# EAGLE design mimamori-hat-v03 (EAGLE 7.7.0)
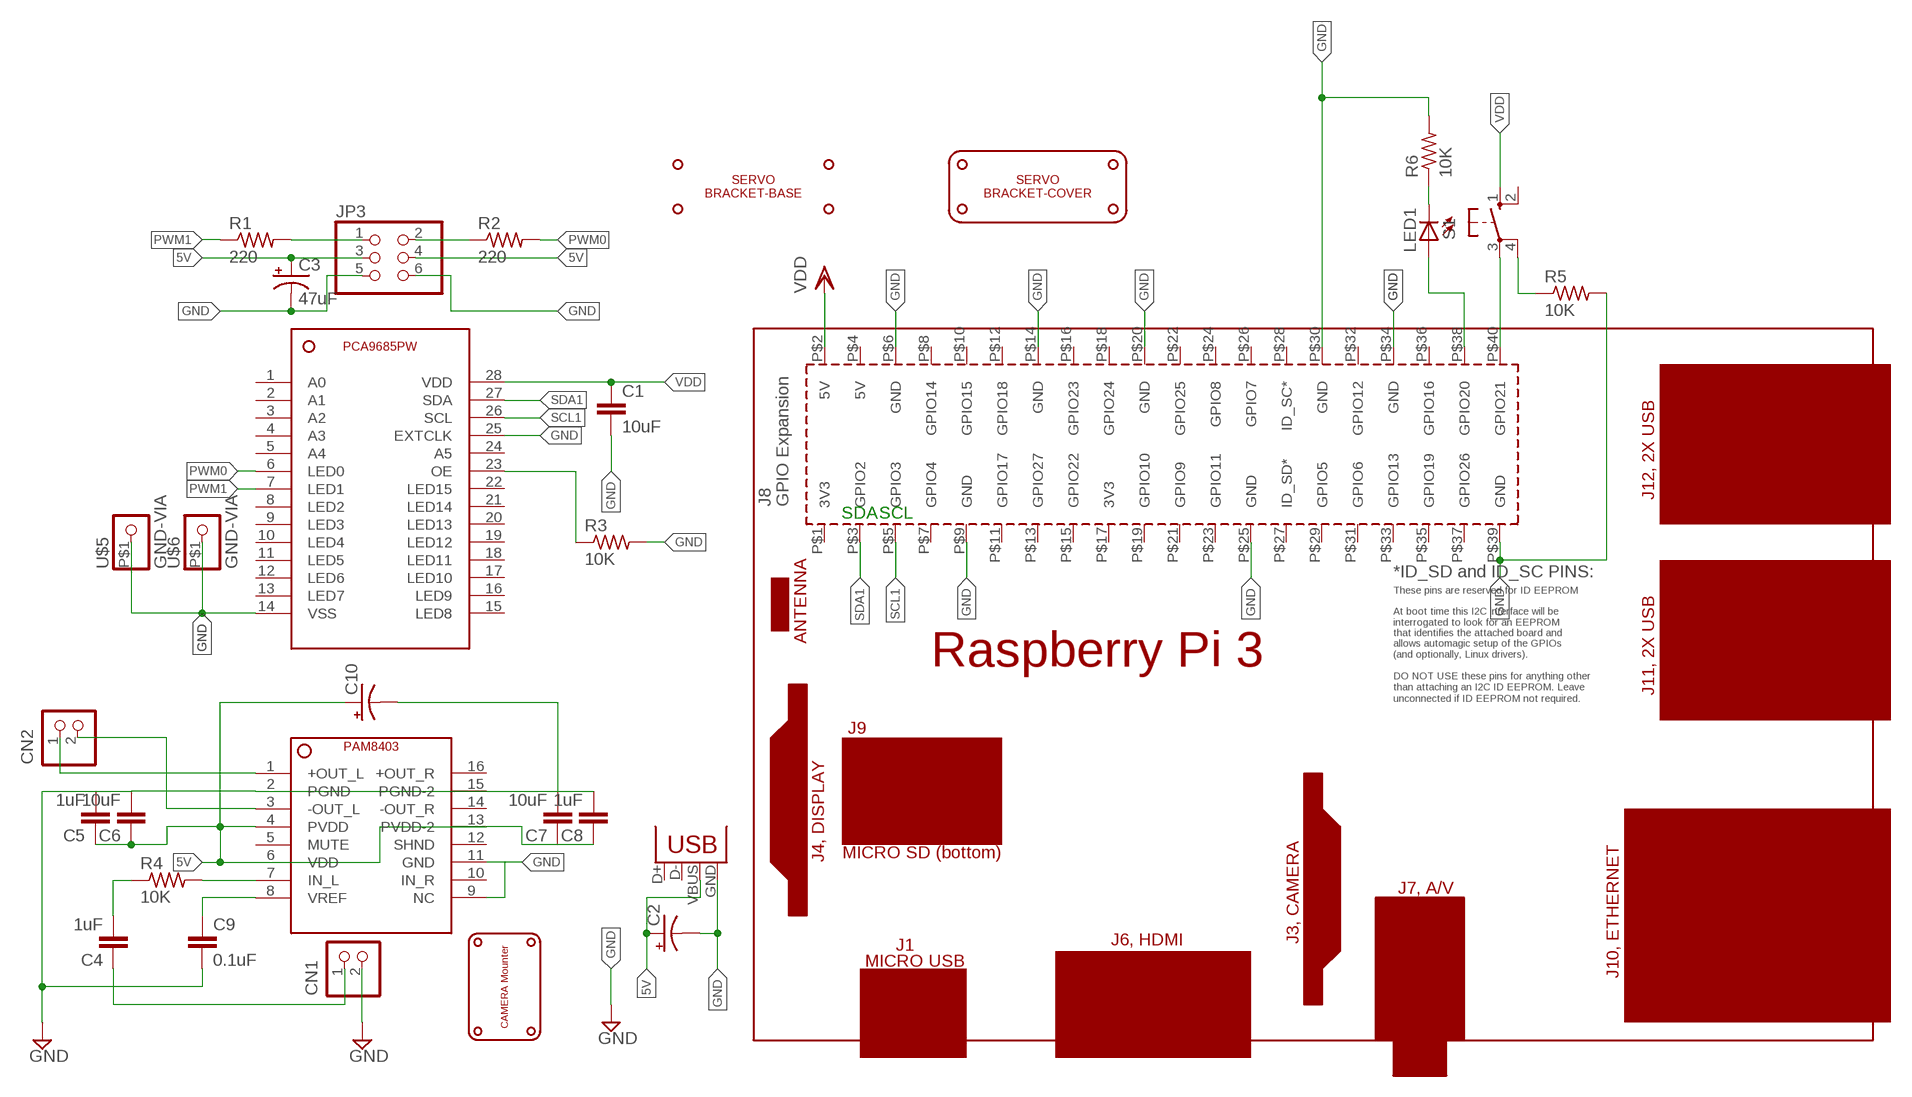
[diagram p0: schematic, sheet 1]

## Parts
C1  10uF  C-EUC0805  [C0805]
C2  CPOL-US153CLV-0810  [153CLV-0810]
C3  47uF  CPOL-US153CLV-0605  [153CLV-0605]
C4  1uF  C-EUC0805  [C0805]
C5  1uF  C-EUC0805  [C0805]
C6  10uF  C-EUC0805  [C0805]
C7  10uF  C-EUC0805  [C0805]
C8  1uF  C-EUC0805  [C0805]
C9  0.1uF  C-EUC0805  [C0805]
C10  CPOL-US153CLV-0810  [153CLV-0810]
CN1  B2B-PH-K-S  [B2B-PH-K-S]
CN2  B2B-PH-K-S  [B2B-PH-K-S]
JP1  USB-MICROB  [USB-MICROB]
JP3  PINHD-2X3  [2X03]
LED1  LED3MM  [LED3MM]
PCB1  RPI3  [RPI3]
R1  220  R-US_R0805  [R0805]
R2  220  R-US_R0805  [R0805]
R3  10K  R-US_R0805  [R0805]
R4  10K  R-US_R0805  [R0805]
R5  10K  R-US_R0805  [R0805]
R6  10K  R-US_R0805  [R0805]
S1  10-XX  [B3F-10XX]
U$1  PAM8403  [SOP16]
U$2  PCA9685PW  [TSSOP28]
U$3  CAMERA-MOUNTER  [CAMERA-MOUNTER]
U$4  SERVO-BRACKET-BASE  [SERVO-BRACKET]
U$5  GND-VIA  [GND-VIA]
U$6  GND-VIA  [GND-VIA]
U$7  SERVO-BRACKER-COVER  [SERVO-BRACKET-COVER]

## Nets
5V: C2.+ C3.+ C5.1 C6.1 C7.1 C8.1 C10.+ JP1.VBUS JP3.3 JP3.4 U$1.4(PVDD) U$1.6(VDD) U$1.13(PVDD-2)
GND: C1.2 C2.- C3.- C5.2 C6.2 C7.2 C8.2 C9.2 C10.- CN1.2 JP1.GND JP3.5 JP3.6 PCB1.P$6(GND) PCB1.P$9(GND) PCB1.P$14(GND) PCB1.P$20(GND) PCB1.P$25(GND) PCB1.P$30(GND) PCB1.P$34(GND) PCB1.P$39(GND) R3.2 R5.2 R6.2 U$1.2(PGND) U$1.9(NC) U$1.11(GND) U$1.15(PGND-2) U$2.14(VSS) U$2.25(EXTCLK) U$5.P$1 U$6.P$1
N$1: JP3.1 R1.2
N$2: JP3.2 R2.1
N$3: R3.1 U$2.23(OE)
N$4: C4.1 CN1.1
N$5: C4.2 R4.1
N$6: R4.2 U$1.7(IN_L)
N$7: C9.1 U$1.8(VREF)
N$8: CN2.1 U$1.1(+OUT_L)
N$9: CN2.2 U$1.3(-OUT_L)
N$10: R5.1 S1.4(P1)
N$12: PCB1.P$40(GPIO21) S1.3(P)
N$13: LED1.A PCB1.P$38(GPIO20)
N$14: LED1.K(C) R6.1
PWM0: R2.2 U$2.6(LED0)
PWM1: R1.1 U$2.7(LED1)
SCL1: PCB1.P$5(GPIO3) U$2.26(SCL)
SDA1: PCB1.P$3(GPIO2) U$2.27(SDA)
VDD: C1.1 PCB1.P$2(5V) S1.1(S) U$2.28(VDD)
Unconnected: JP1.D+ JP1.D- PCB1.P$1(3V3) PCB1.P$4(5V) PCB1.P$7(GPIO4) PCB1.P$8(GPIO14) PCB1.P$10(GPIO15) PCB1.P$11(GPIO17) PCB1.P$12(GPIO18) PCB1.P$13(GPIO27) PCB1.P$15(GPIO22) PCB1.P$16(GPIO23) PCB1.P$17(3V3) PCB1.P$18(GPIO24) PCB1.P$19(GPIO10) PCB1.P$21(GPIO9) PCB1.P$22(GPIO25) PCB1.P$23(GPIO11) PCB1.P$24(GPIO8) PCB1.P$26(GPIO7) PCB1.P$27(ID_SD*) PCB1.P$28(ID_SC*) PCB1.P$29(GPIO5) PCB1.P$31(GPIO6) PCB1.P$32(GPIO12) PCB1.P$33(GPIO13) PCB1.P$35(GPIO19) PCB1.P$36(GPIO16) PCB1.P$37(GPIO26) S1.2(S1) U$1.5(MUTE) U$1.10(IN_R) U$1.12(SHND) U$1.14(-OUT_R) U$1.16(+OUT_R) U$2.1(A0) U$2.2(A1) U$2.3(A2) U$2.4(A3) U$2.5(A4) U$2.8(LED2) U$2.9(LED3) U$2.10(LED4) U$2.11(LED5) U$2.12(LED6) U$2.13(LED7) U$2.15(LED8) U$2.16(LED9) U$2.17(LED10) U$2.18(LED11) U$2.19(LED12) U$2.20(LED13) U$2.21(LED14) U$2.22(LED15) U$2.24(A5)

## Notes on the sheet
- SDA | SCL

## Library data of the parts
C1 C4-C9 = 0my:C-EU: CAPACITOR, European symbol
C2 C3 C10 = 0my:CPOL-US: POLARIZED CAPACITOR, American symbol
CN1 CN2 = 0-cheen:B2B-PH-*: Wire-to-Board 2.0mm pitch top mount connector Source: http://www.jst-mfg.com/product/pdf/jpn/PH.pdf http://www.jst-mfg.com/product/detail.php?series=199
JP1 = 0my:USB: USB Connectors USB-B-PTH is fully proven SKU : PRT-00139/CONN-08278 USB-miniB is fully proven SKU : PRT-00587 USB-A-PCB is untested. USB-A-H is throughly reviewed, but untested. Spark Fun Electronics SKU : PRT-00437 USB-B-SMT is throughly reviewed, but untested. Needs silkscreen touching up. USB-A-S has not been used/tested USB-MB-H has not been used/tested USB-MICROB has been used. CONN-09505; PROD_ID: CONN-09505
JP3 = 0my:PINHD-2X3: PIN HEADER
LED1 = adafruit:LED: LED OSRAM: - CHIPLED LG R971, LG N971, LY N971, LG Q971, LY Q971, LO R971, LY R971 LH N974, LH R974 LS Q976, LO Q976, LY Q976 LO Q996 - Hyper CHIPLED LW Q18S LB Q993, LB Q99A, LB R99A - SideLED LS A670, LO A670, LY A670, LG A670, LP A670 LB A673, LV A673, LT A673, LW A673 LH A674 LY A675 LS A676, LA A676, LO A676, LY A676, LW A676 LS A679, LY A679, LG A679 - Hyper Micro SIDELED® LS Y876, LA Y876, LO Y876, LY Y876 LT Y87S - SmartLED LW L88C, LW L88S LB L89C, LB L89S, LG L890 LS L89K, LO L89K, LY L89K LS L896, LA L896, LO L896, LY L896 - TOPLED LS T670, LO T670, LY T670, LG T670, LP T670 LSG T670, LSP T670, LSY T670, LOP T670, LYG T670 LG T671, LOG T671, LSG T671 LB T673, LV T673, LT T673, LW T673 LH T674 LS T676, LA T676, LO T676, LY T676, LB T676, LH T676, LSB T676, LW T676 LB T67C, LV T67C, LT T67C, LS T67K, LO T67K, LY T67K, LW E67C LS E67B, LA E67B, LO E67B, LY E67B, LB E67C, LV E67C, LT E67C LW T67C LS T679, LY T679, LG T679 LS T770, LO T770, LY T770, LG T770, LP T770 LB T773, LV T773, LT T773, LW T773 LH T774 LS E675, LA E675, LY E675, LS T675 LS T776, LA T776, LO T776, LY T776, LB T776 LHGB T686 LT T68C, LB T68C - Hyper Mini TOPLED® LB M676 - Mini TOPLED Santana® LG M470 LS M47K, LO M47K, LY M47K Source: http://www.osram.convergy.de/
PCB1 = 0_Rpi3_RevA:RPI3: Device for Raspberry Pi 3 board created by Dave Young for www.element14.com More information and support community is available at https://www.element14.com/community/community/raspberry-pi
R1-R6 = 0my:R-US_: RESISTOR, American symbol
S1 = switch-omron:10-XX: OMRON SWITCH; MPN: B3F-1000; OC_FARNELL: 176432; OC_NEWARK: 36M3542
U$1 = 0_Rpi3_RevA:PAM8403
U$2 = 0_Rpi3_RevA:PCA9685PW
U$3 = 0_Rpi3_RevA:CAMERA-MOUNTER
U$4 = 0_Rpi3_RevA:SERVO-BRACKET-BASE
U$5 U$6 = 1my:GND-VIA
U$7 = 0_Rpi3_RevA:SERVO-BRACKER-COVER

## Board
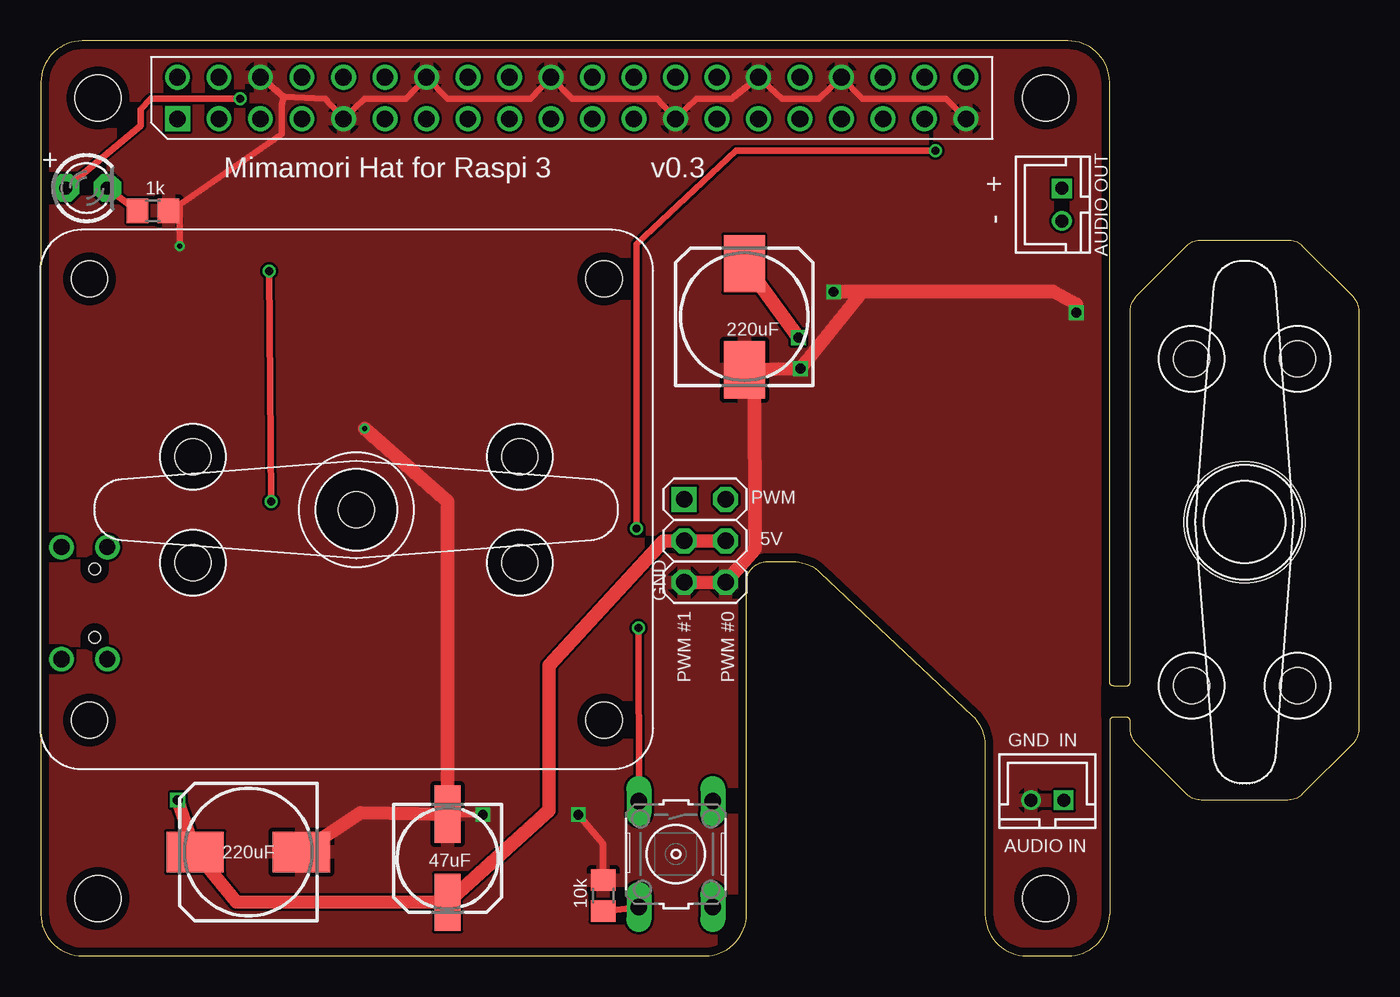
[diagram p1: board, top side]
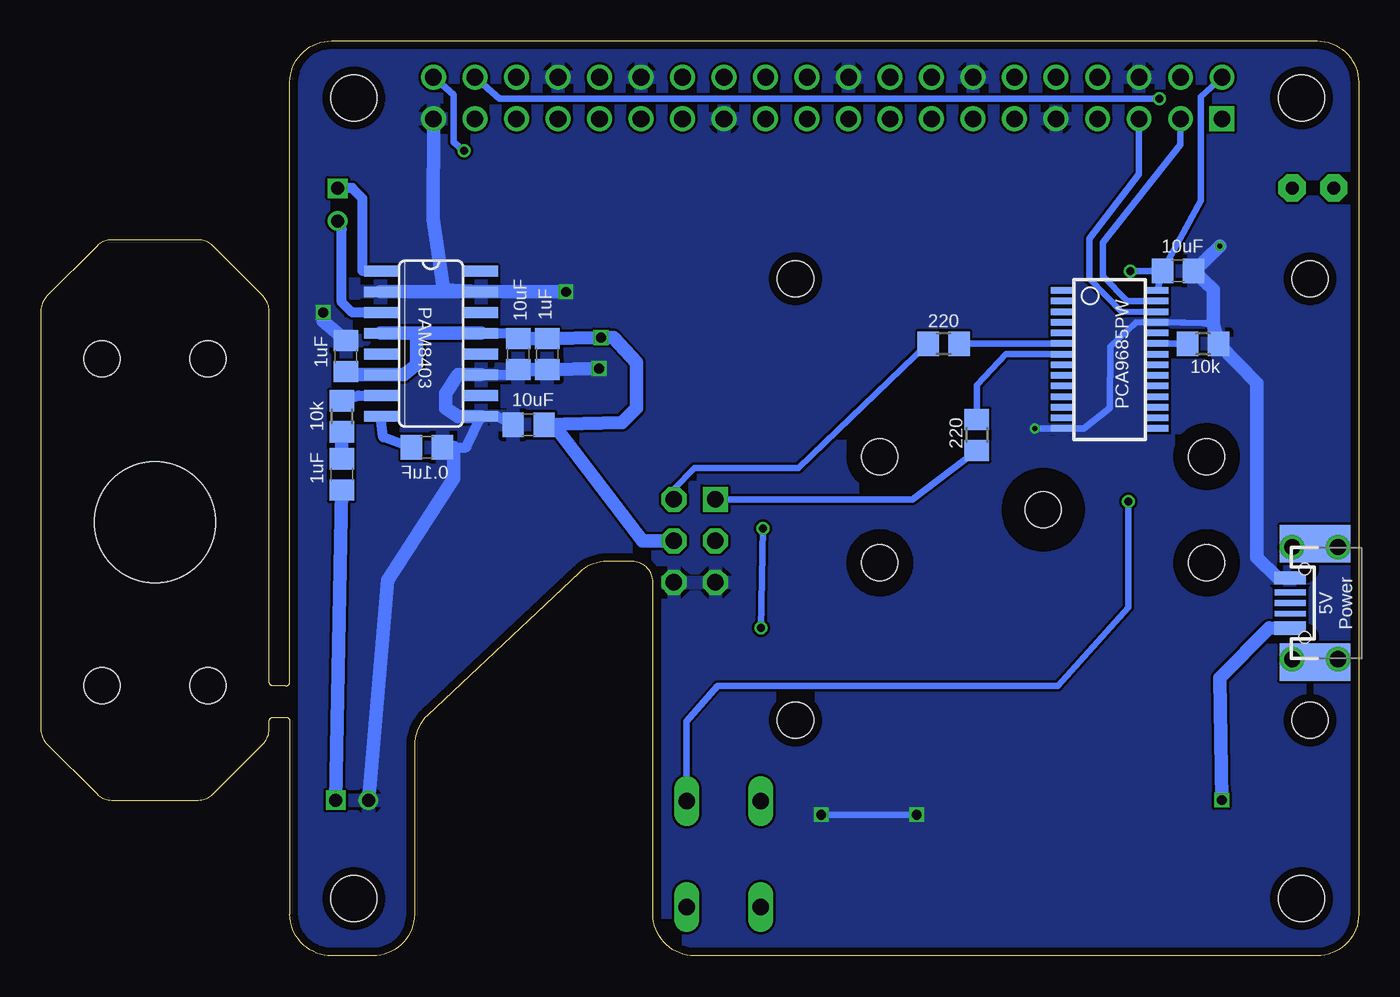
[diagram p2: board, bottom side, seen from below]

Size 80.64 x 56 mm. Coordinates in mm from the lower left corner, seen from the top.
Outline: 62.84,56 2.54,56 arc90 0,53.46 0,2.54 arc90 2.54,0 40.64,0 arc90 43.18,2.54 43.18,22.86 arc-90 44.45,24.13 45.98,24.13 arc-43 47.72,23.44 56.99,14.72 arc-47 57.78,12.87 57.78,2.54 arc90 60.33,0 62.84,0 arc90 65.41,2.54 65.41,14.35 arc-90 65.66,14.61 66.42,14.61 arc-90 66.67,14.35 66.67,13.86 arc45 67.05,12.96 70.11,9.9 arc45 71.01,9.53 76.31,9.53 arc45 77.21,9.9 80.27,12.96 arc45 80.64,13.86 80.64,39.48 arc45 80.27,40.38 77.21,43.44 arc45 76.31,43.81 71.01,43.81 arc45 70.11,43.44 67.05,40.38 arc45 66.67,39.48 66.67,16.76 arc-90 66.42,16.51 65.66,16.51 arc-90 65.41,16.76 65.41,53.47 arc90 62.84,56
Copper layers (1*16): Top 0.035mm / dielectric 1.6mm / Bottom 0.035mm
Design rules "Elecrow_2-layer_PCB_eagle_rule": minimum track width 6mil, minimum drill 12mil, track to track 6mil, track to pad 8mil, pad to pad 12mil, via to via 12mil, smd to smd 0mil, copper to edge 20mil, drill to drill 10mil, minimum pad ring 6mil, minimum via ring 6mil, stop-mask expansion 0mil, vias tented up to drill 100mil, thermal gap 10mil
tRestrict: area 65,14.6 to 66.8,16.5
bRestrict: area 65,14.6 to 66.8,16.5

### Footprints (pad centres in the part's own frame; a part is rotated, then mirrored left to right if it is on the bottom)
C0805 = smd 1.3 x 1.5: 1 -0.95,0; 2 0.95,0
153CLV-0810 = smd 3.5 x 2.5: + 3.25,0; - -3.25,0
153CLV-0605 = smd 3.5 x 1.6: + 2.7,0; - -2.7,0
B2B-PH-K-S = drill 0.8 square: 1 -1,0 | drill 0.8: 2 1,0
USB-MICROB = smd 0.35 x 1.9: D+ 0,2.904; D- -0.65,2.904; ID 0.65,2.904 | smd 0.813 x 1.93: GND 1.541,2.929; VBUS -1.541,2.929 | smd 2.286 x 4.318: MT1 3.62,1.397; MT3 -3.619,1.397 | drill 1: P$2 -3.429,2.794; P$4 -3.429,0; P$5 3.429,2.794; P$6 3.429,0 | hole 0.7: -2.095,2.032; 2.095,2.032
2X03 = drill 1.016 square: 1 -2.54,-1.27 | drill 1.016 octagon: 2 -2.54,1.27; 3 0,-1.27; 4 0,1.27; 5 2.54,-1.27; 6 2.54,1.27
LED3MM = drill 0.813 pad 1.676 octagon: A -1.27,0; K 1.27,0
RPI3 = drill 1.016 square: P$1 8.37,51.23 | drill 1.016: P$2 8.357,53.772; P$3 10.897,51.232; P$4 10.897,53.772; P$5 13.437,51.232; P$6 13.437,53.772; P$7 15.977,51.232; P$8 15.977,53.772; P$9 18.517,51.232; P$10 18.517,53.772; P$11 21.057,51.232; P$12 21.057,53.772; P$13 23.597,51.232; P$14 23.597,53.772; P$15 26.137,51.232; P$16 26.137,53.772; P$17 28.677,51.232; P$18 28.677,53.772; P$19 31.217,51.232; P$20 31.217,53.772; P$21 33.757,51.232; P$22 33.757,53.772; P$23 36.297,51.232; P$24 36.297,53.772; P$25 38.837,51.232; P$26 38.837,53.772; P$27 41.377,51.232; P$28 41.377,53.772; P$29 43.917,51.232; P$30 43.917,53.772; P$31 46.457,51.232; P$32 46.457,53.772; P$33 48.997,51.232; P$34 48.997,53.772; P$35 51.537,51.232; P$36 51.537,53.772; P$37 54.077,51.232; P$38 54.077,53.772; P$39 56.617,51.232; P$40 56.617,53.772 | hole 2.8: 3.5,3.5; 61.5,3.5; 3.5,52.5; 61.5,52.5
R0805 = smd 1.3 x 1.5: 1 -0.95,0; 2 0.95,0
B3F-10XX = drill 1.016 long: 1 -3.251,2.261; 2 3.251,2.261; 3 -3.251,-2.261; 4 3.251,-2.261
SOP16 = smd 0.66 x 2.032: 1 1.016,-1.041; 2 2.286,-1.041; 3 3.556,-1.041; 4 4.826,-1.041; 5 6.096,-1.041; 6 7.366,-1.041; 7 8.636,-1.041; 8 9.906,-1.041; 9 9.906,5.105; 10 8.636,5.105; 11 7.366,5.105; 12 6.096,5.105; 13 4.826,5.105; 14 3.556,5.105; 15 2.286,5.105; 16 1.016,5.105
TSSOP28 = smd 0.4 x 1.35: 1 1.236,-0.385; 2 1.886,-0.385; 3 2.536,-0.385; 4 3.186,-0.385; 5 3.836,-0.385; 6 4.486,-0.385; 7 5.136,-0.385; 8 5.786,-0.385; 9 6.436,-0.385; 10 7.086,-0.385; 11 7.736,-0.385; 12 8.386,-0.385; 13 9.036,-0.385; 14 9.686,-0.385; 15 9.686,5.465; 16 9.036,5.465; 17 8.386,5.465; 18 7.736,5.465; 19 7.086,5.465; 20 6.436,5.465; 21 5.786,5.465; 22 5.136,5.465; 23 4.486,5.465; 24 3.836,5.465; 25 3.186,5.465; 26 2.536,5.465; 27 1.886,5.465; 28 1.236,5.465
CAMERA-MOUNTER = hole 2.2: 3,3; 30,3; 3,34.5; 30,34.5
SERVO-BRACKET = hole 2.2: 0,0; -10,-3.25; -10,3.25; 10,3.25; 10,-3.25
GND-VIA = drill 0.305 pad 0.508: P$1 0,0
SERVO-BRACKET-COVER = hole 7.4: 0,0 | hole 2.2: -10,-3.25; -10,3.25; 10,3.25; 10,-3.25

### Placement (x,y rotation side)
C1  11.05,41.91 0 bottom
C2  12.7,6.35 180 top
C3  24.89,5.97 270 top
C4  62.23,29.46 90 bottom
C5  61.98,36.7 90 bottom
C6  50.8,32.51 180 bottom
C7  51.44,36.83 270 bottom
C8  49.66,36.83 270 bottom
C9  57.02,31.11 0 bottom
C10  43.05,39.12 90 top
CN1  61.59,9.53 180 top
CN2  62.48,45.97 270 top
JP1  1.27,21.59 90 bottom
JP3  40.64,25.4 270 top
LED1  2.79,46.99 0 top
PCB1  0,0 0 top
R1  23.37,31.88 270 bottom
R2  25.4,37.47 0 bottom
R3  9.53,37.47 0 bottom
R4  62.23,33.02 90 bottom
R5  34.42,3.68 90 top
R6  6.86,45.59 0 top
S1  38.86,6.22 270 top
U$1  58.8,42.93 270 bottom
U$2  17.78,41.96 270 bottom
U$3  37.47,11.43 90 top
U$4  19.3,27.3 0 top
U$5  19.81,32.26 0 top
U$6  8.51,43.43 0 top
U$7  73.66,26.54 90 top

### Tracks (layer width: path | path; a pad name or v marks a point on that pad's centre or on a via)
5V  (via drill 0.6)
  Top 0.813: JP3.4 JP3.3 38.1,25.4 31.11,17.78 31.11,8.89 C3.+ 11.94,3.3 C2.+ v8.38,9.53 | v46.35,37.85 C10.+
  Bottom 0.61: U$1.13 52.07,38.1 C7.1
  Bottom 0.813: JP3.4 43.81,25.4 49.28,32.51 C6.1 45.09,32.64 44.2,33.53 44.2,36.32 45.59,37.85 v46.35,37.85 C8.1 C7.1 | C5.1 61.21,35.56 U$1.6 58.42,35.56 57.66,36.2 57.66,38.1 U$1.4 U$1.13 | JP1.VBUS 5.46,20.07 8.51,17.02 v8.38,9.53
GND  (via drill 0.6)
  Top 0.406: PCB1.P$39 55.37,52.45 50.29,52.45 PCB1.P$34 47.62,52.45 45.34,52.45 PCB1.P$30 42.42,52.58 42.29,52.45 40.13,52.45 PCB1.P$25 37.72,52.45 32.51,52.45 PCB1.P$20 29.97,52.45 24.89,52.45 PCB1.P$14 22.35,52.45 19.81,52.45 PCB1.P$9 17.4,52.45 14.86,52.58 | 14.86,52.58 PCB1.P$6 | 14.86,52.58 14.73,52.07 14.73,50.29 8.51,45.97 8.51,45.72 | 8.51,45.72 U$6.P$1 | R5.2 34.42,6.86 v32.89,8.64 | v27.05,8.64 C3.- | R6.2 8.51,45.72
  Top 0.813: C2.- 19.56,8.76 C3.- 24.89,27.81 U$5.P$1 | 43.67,35.88 v46.48,35.94 50.29,40.64 v48.51,40.64 61.98,40.64 63.37,39.88 v63.37,39.37 | 43.67,35.88 C10.- | JP3.5 JP3.6 43.69,24.89 43.67,35.88
  Bottom 0.406: U$2.25 13.64,38.76 15.19,37.29 15.24,33.53 16.82,32.26 U$2.14 U$5.P$1 | 8.89,38.61 9.53,38.73 U$2.25 | U$2.25 8.89,38.73 | v32.89,8.64 v27.05,8.64
  Bottom 0.61: C9.2 55.37,31.11 54.61,31.11 U$1.9 52.7,33.02 C6.2 | U$1.11 52.07,35.56 C7.2
  Bottom 0.813: U$1.11 55.12,35.56 55.88,34.42 55.88,33.53 55.12,33.02 U$1.9 | C7.2 C8.2 v46.48,35.94 | U$1.2 U$1.15 | U$1.15 56.01,40.77 56.64,45.09 PCB1.P$39 | U$1.15 v48.51,40.64 | C5.2 63.37,38.86 v63.37,39.37 | JP1.GND 4.95,23.11 6.22,24.38 6.22,35.05 R3.2 8.89,38.61 | 8.89,38.73 8.89,40.77 C1.2 U$6.P$1 | CN1.2 59.44,22.99 55.37,29.21 55.37,31.11
  pour Top: -1.27,57.15 67.31,57.15 67.31,-1.27 -1.27,-1.27
  pour Bottom: 0,58.42 66.04,58.42 66.04,-2.54 0,-2.54
N$1
  Bottom 0.406: R1.2 27.3,27.94 JP3.1
N$2
  Bottom 0.406: R2.1 34.29,29.84 40.64,29.84 41.91,28.57 JP3.2
N$3
  Bottom 0.406: U$2.23 R3.1
N$4
  Bottom 0.813: CN1.1 C4.1
N$5
  Bottom 0.813: R4.1 C4.2
N$6
  Bottom 0.61: R4.2 61.21,34.29 U$1.7
N$7
  Bottom 0.61: C9.1 59.69,31.75 U$1.8
N$8
  Bottom 0.61: U$1.1 60.96,41.91 60.96,46.35 61.59,46.99 CN2.1
N$9
  Bottom 0.61: U$1.3 61.59,39.37 62.23,40.01 62.23,44.45 CN2.2
N$10
  Top 0.406: R5.1 S1.4
N$12  (via drill 0.5)
  Top 0.406: S1.3 v36.58,20.07 | v36.45,26.16 36.45,43.56 42.55,49.28 v54.74,49.28
  Bottom 0.406: v36.58,20.07 v36.45,26.16 | v54.74,49.28 55.37,49.78 55.37,52.7 PCB1.P$40
N$13  (via drill 0.5)
  Top 0.406: v12.19,52.45 6.73,52.45 6.1,51.82 6.1,50.8 LED1.A
  Bottom 0.406: PCB1.P$38 52.58,52.45 v12.19,52.45
N$14
  Top 0.406: LED1.K R6.1
PWM0
  Bottom 0.406: U$2.6 R2.2
PWM1
  Bottom 0.406: U$2.7 21.59,36.83 23.37,34.92 R1.1
SCL1
  Bottom 0.406: U$2.26 14.5,39.4 16.48,41.45 16.48,43.89 13.46,47.85 PCB1.P$5
SDA1
  Bottom 0.406: U$2.27 13.49,40.08 14.15,40.08 15.65,41.6 15.65,43.66 10.92,49.66 PCB1.P$3
VDD  (via drill 0.5)
  Top 0.406: v14.1,27.81 v13.97,41.91
  Bottom 0.406: U$2.28 C1.1 | C1.1 9.65,46.23 9.65,52.58 PCB1.P$2 | S1.1 41.15,14.35 39.24,16.51 18.41,16.51 14.1,21.34 v14.1,27.81 | v13.97,41.91 C1.1

### Text on the board
_tNames: Mimamori Hat for Raspi 3 | v0.3 | 1k | + | AUDIO OUT | - | 220uF | PWM | 5V | GND | PWM #1 | PWM #0 | GND | IN | AUDIO IN | 220uF | 47uF | 10k
_bNames: 10uF | 1uF | 10uF | 220 | PCA9685PW | PAM8403 | 1uF | 10k | 10uF | 10k | 220 | 0.1uF | 1uF | 5V / Power